# Altium schematic sheet RECOM_24to3v3.SchDoc
size A
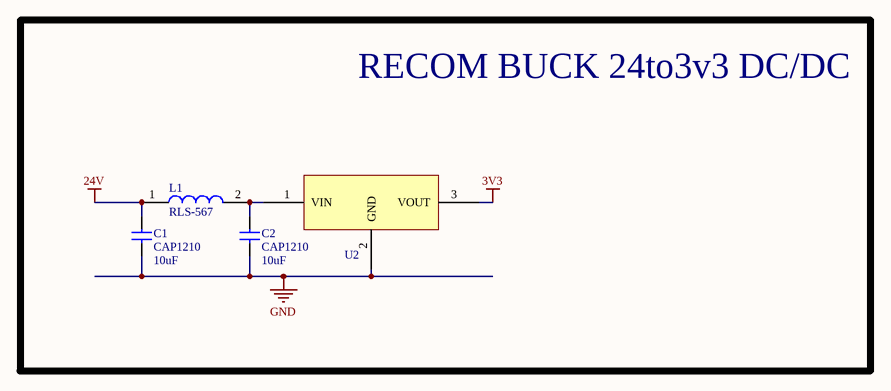
[diagram p0: RECOM_24to3v3.SchDoc]

## Parts
C1  CAP1210  value 10uF  [CAP1210]
C2  CAP1210  value 10uF  [CAP1210]
L1  RLS-567  [RLS567]
U2  R-78C3.3-1.0  [R-78C3.3-1.0]  (value not drawn)

## Blocks framed on the sheet
RECOM BUCK 24to3v3 DC/DC: C1 C2 L1 U2

## Nets
3V3: U2.3(VOUT)
24V: C1.1(A) L1.1
GND: C1.2(B) C2.2(B) U2.2(GND)
NetC2_1: C2.1(A) L1.2 U2.1(VIN)

## Library data of the parts
C1 C2 = CAP1210: CAP CER 10UF 50V 20% X5R 1210; Supplier 1: Digi-Key; Supplier Part Number 1: CGA6P1X7R1N106K250AC
L1 = RLS-567: Inductor; Manufacturer_Name: RECOM Power; Datasheet Link: https://componentsearchengine.com/Datasheets/1/RLS-567.pdf; Height: 3.1mm; Mouser Part Number: 919-RLS-567; Mouser Price/Stock: https://www.mouser.com/Search/Refine.aspx?Keyword=919-RLS-567; Manufacturer_Part_Number: RLS-567
U2 = R-78C3.3-1.0: CONV DC/DC 1A 3.3V OUT SIP VERT; Supplier 1: Digi-Key; Supplier Part Number 1: 945-1394-5-ND